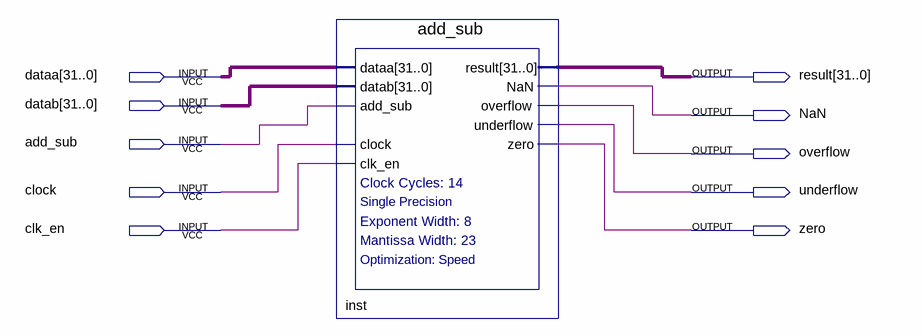
[diagram p0: schematic sheet]
// Quartus schematic lab11_2.bdf as structural Verilog: 1 symbols, 10 pins
module lab11_2 (
  input  [31:0] dataa,
  input  [31:0] datab,
  input  add_sub,
  input  clock,
  input  clk_en,
  output [31:0] result,
  output NaN,
  output overflow,
  output underflow,
  output zero
);

  add_sub inst (
    .dataa(dataa), .datab(datab), .add_sub(add_sub), .clock(clock), .clk_en(clk_en), .result(result),
    .NaN(NaN), .overflow(overflow), .underflow(underflow), .zero(zero));
endmodule
